# Altium schematic sheet MACH.SchDoc
size A0; SheetNumber: 1; SheetTotal: 1
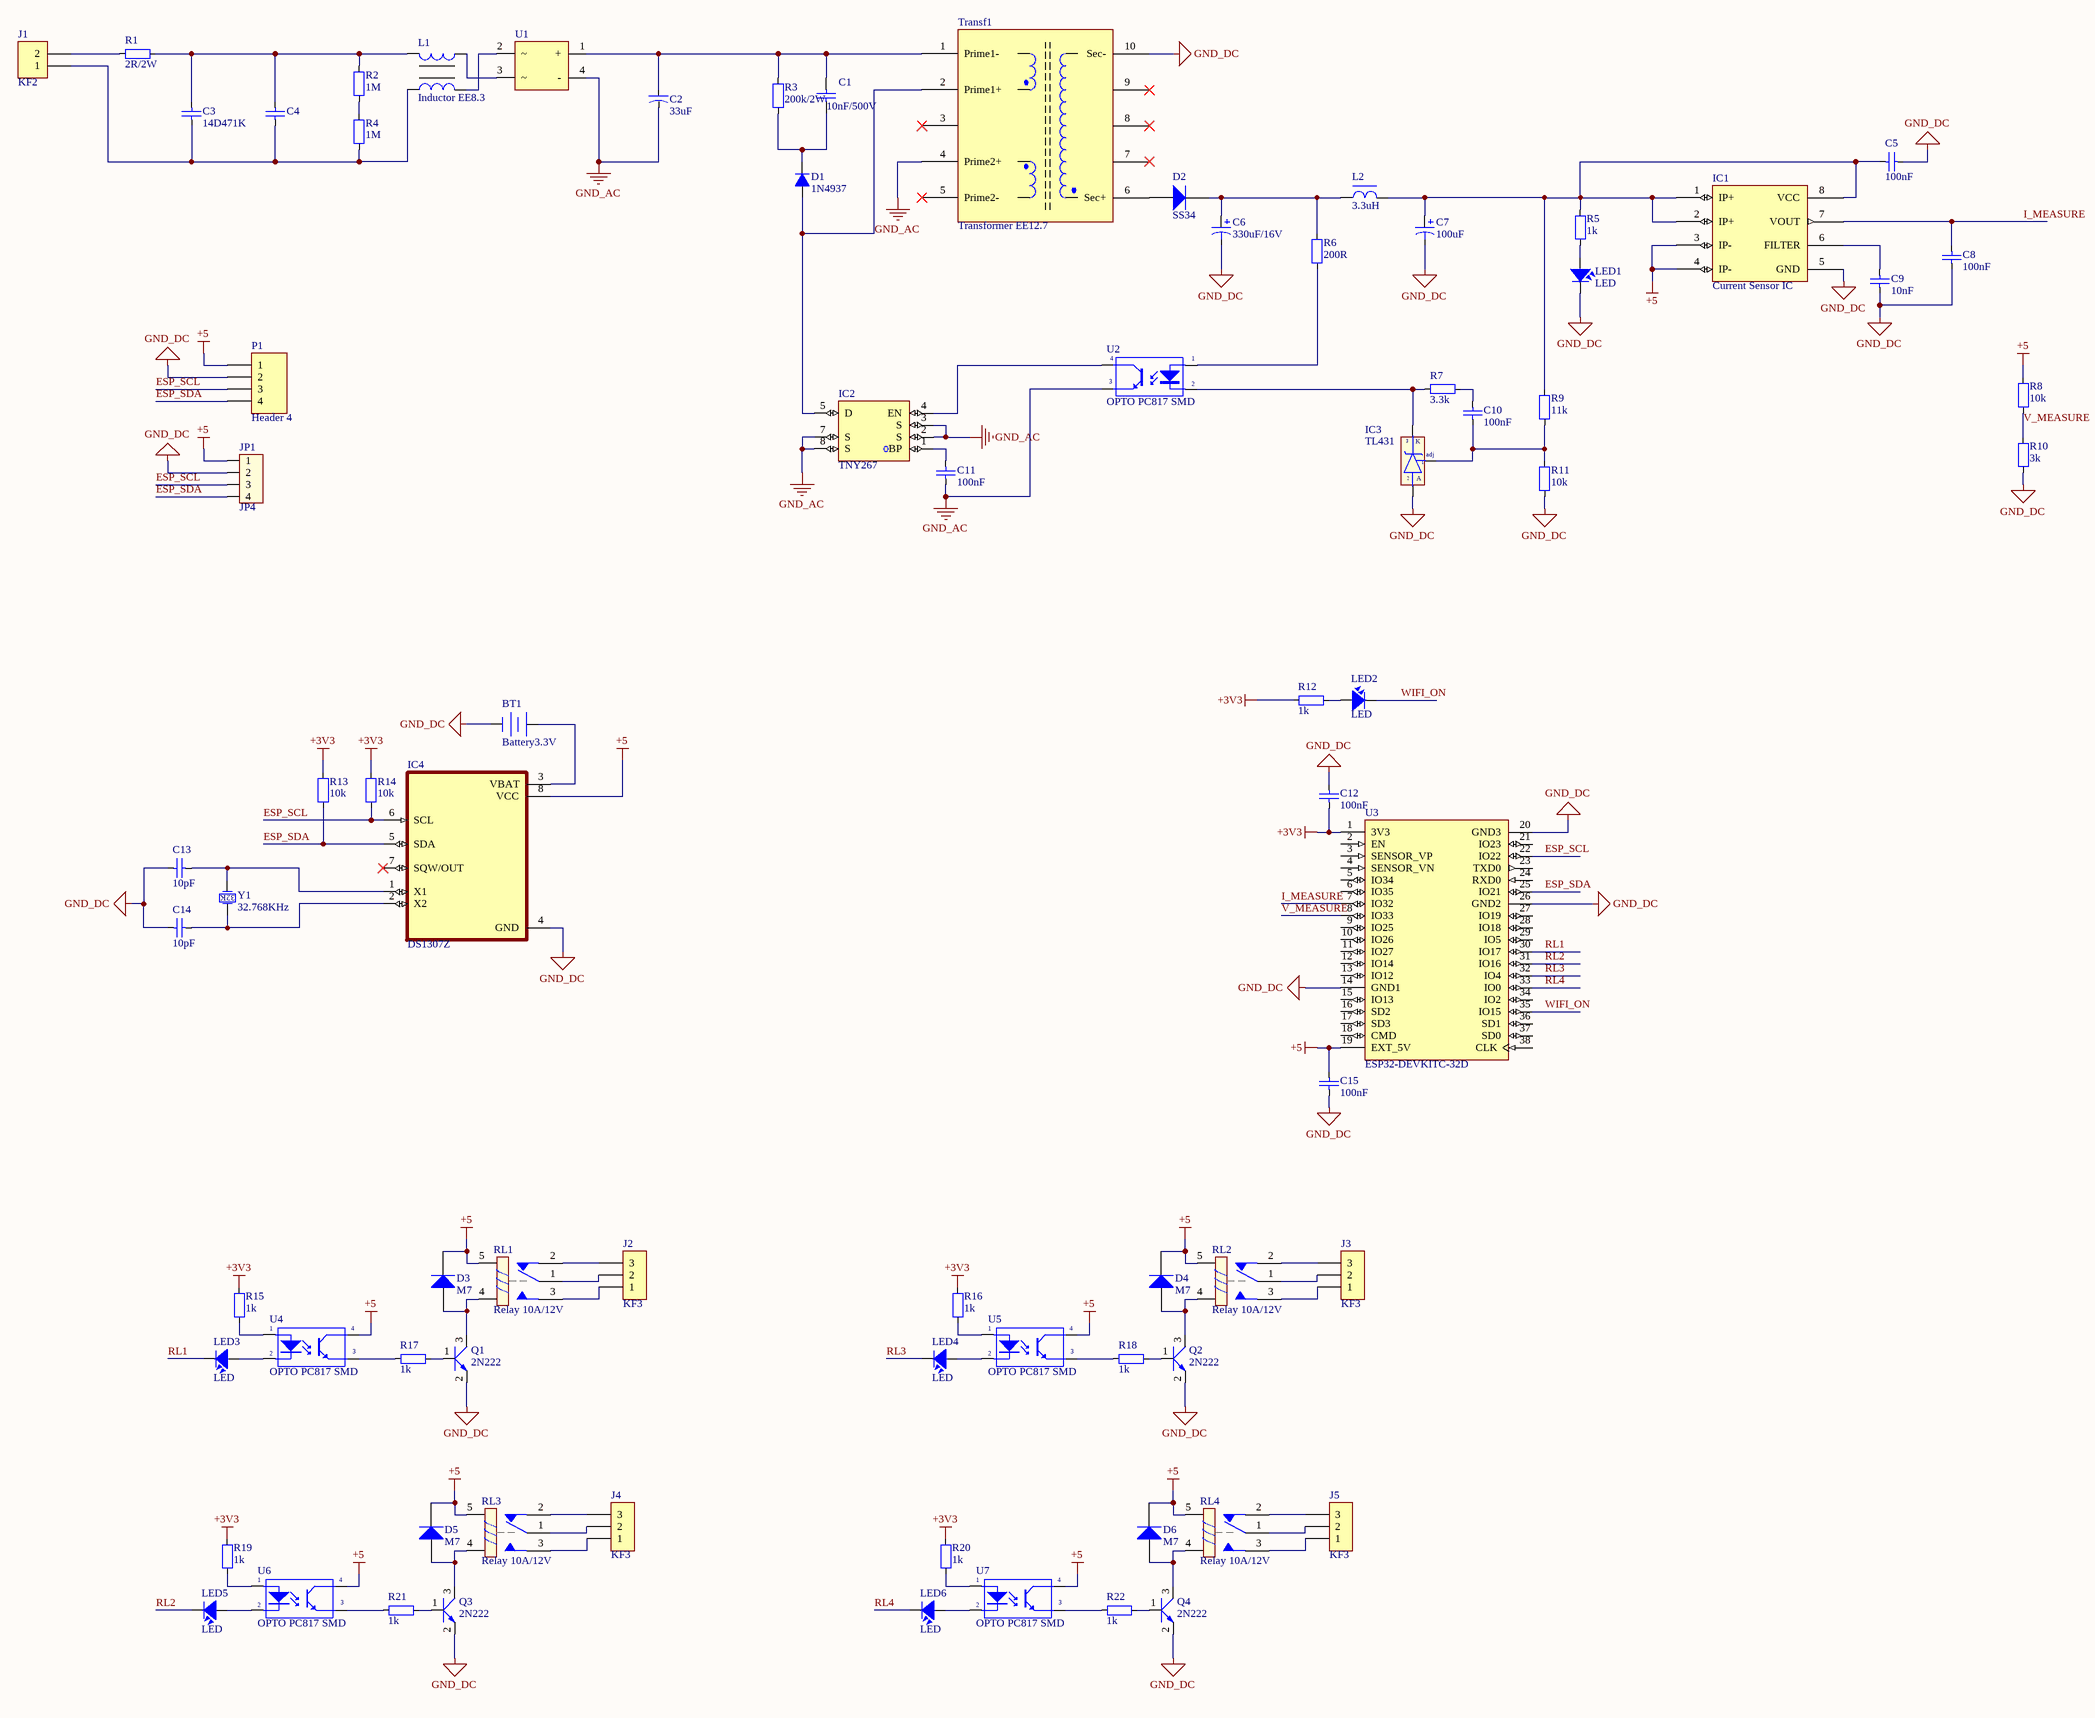
[diagram p0: MACH.SchDoc]

## Parts
BT1  Battery3.3V  [CR1220 SMD]
C1  10nF/500V  [tu gom]
C2  33uF  [CA-ALU-8]
C3  14D471K  [103/2KV]
C4  Cap AC filter  [Cap AC filter]  (value not drawn)
C5  100nF  [CAP_0805]
C6  330uF/16V  [C8mm]
C7  100uF  [C8mm]
C8  100nF  [CAP_0805]
C9  10nF  [CAP_0805]
C10  100nF  [CAP_0805]
C11  100nF  [CAP_0805]
C12  100nF  [CAP_0805]
C13  10pF  [CAP_0603]
C14  10pF  [CAP_0603]
C15  100nF  [CAP_0805]
D1  1N4937  [D5AN]
D2  SS34  [DIODE SMA]
D3  M7  [DIODE SMA]
D4  M7  [DIODE SMA]
D5  M7  [DIODE SMA]
D6  M7  [DIODE SMA]
IC1  Current Sensor IC  [SOIC-8]
IC2  TNY267  [TNY264]
IC3  TL431  [qto-92]
IC4  DS1307Z  [SOIC-8]
J1  KF2  [KF2-5.08]
J2  KF3  [KF3-5.08]
J3  KF3  [KF3-5.08]
J4  KF3  [KF3-5.08]
J5  KF3  [KF3-5.08]
JP1  JP4  [CON4]
L1  Inductor EE8.3  [Inductor EE8.3]
L2  3.3uH  [L-SMD-M-7.3x4.5]
LED1  LED  [LED-0805-Red]
LED2  LED  [LED-0805-Red]
LED3  LED  [LED-0805-Red]
LED4  LED  [LED-0805-Red]
LED5  LED  [LED-0805-Red]
LED6  LED  [LED-0805-Red]
P1  Header 4  [HDR1X4]
Q1  2N222  [SOT23D]
Q2  2N222  [SOT23D]
Q3  2N222  [SOT23D]
Q4  2N222  [SOT23D]
R1  2R/2W  [RES-1WD]
R2  1M  [RES-SMD-1206]
R3  200k/2W  [RES-1WD]
R4  1M  [RES-SMD-1206]
R5  1k  [RES-SMD-0805]
R6  200R  [RES-SMD-0805]
R7  3.3k  [RES-SMD-0805]
R8  10k  [RES-SMD-0805]
R9  11k  [RES-SMD-0805]
R10  3k  [RES-SMD-0805]
R11  10k  [RES-SMD-0805]
R12  1k  [RES-SMD-0805]
R13  10k  [RES-SMD-0805]
R14  10k  [RES-SMD-0805]
R15  1k  [RES-SMD-0805]
R16  1k  [RES-SMD-0805]
R17  1k  [RES-SMD-0805]
R18  1k  [RES-SMD-0805]
R19  1k  [RES-SMD-0805]
R20  1k  [RES-SMD-0805]
R21  1k  [RES-SMD-0805]
R22  1k  [RES-SMD-0805]
RL1  Relay 10A/12V  [RELAY 5]
RL2  Relay 10A/12V  [RELAY 5]
RL3  Relay 10A/12V  [RELAY 5]
RL4  Relay 10A/12V  [RELAY 5]
Transf1  Transformer EE12.7  [Transformer EE12.7]
U1  Diode Bridge Flate  [DB207S]  (value not drawn)
U2  OPTO PC817 SMD  [SOP4]
U3  ESP32-DEVKITC-32D  [MODULE_ESP32-DEVKITC-32D]
U4  OPTO PC817 SMD  [SOP4]
U5  OPTO PC817 SMD  [SOP4]
U6  OPTO PC817 SMD  [SOP4]
U7  OPTO PC817 SMD  [SOP4]
Y1  32.768KHz  [XTAL32K]

## Nets
+3V3: C12.1 R12.2 R13.1 R14.1 R15.1 R16.1 R19.1 R20.1 U3.1(3V3)
+5: C15.2 D3.2(K) D4.2(K) D5.2(K) D6.2(K) IC1.3(IP-) IC1.4(IP-) IC4.8(VCC) JP1.1 P1.1 R8.1 RL1.5 RL2.5 RL3.5 RL4.5 U3.19(EXT_5V) U4.4(C) U5.4(C) U6.4(C) U7.4(C)
GND: Y1.0
GND_AC: C2.2 C11.1 IC2.2(S) IC2.3(S) IC2.7(S) IC2.8(S) Transf1.4(Prime2+) U1.4(-) U2.3(E)
GND_DC: BT1.2(-) C5.2 C6.2 C7.2 C8.1 C9.2 C12.2 C13.1 C14.1 C15.1 IC1.5(GND) IC3.2(A) IC4.4(GND) JP1.2 LED1.2 P1.2 Q1.2(E) Q2.2(E) Q3.2(E) Q4.2(E) R10.1 R11.1 Transf1.10(Sec-) U3.14(GND1) U3.20(GND3) U3.26(GND2)
ESP_SCL: IC4.6(SCL) JP1.3 P1.3 R14.2 U3.22(IO22)
ESP_SDA: IC4.5(SDA) JP1.4 P1.4 R13.2 U3.25(IO21)
I_MEASURE: C8.2 IC1.7(VOUT) U3.7(IO32)
RL1: LED3.2 U3.30(IO17)
RL2: LED5.2 U3.31(IO16)
RL3: LED4.2 U3.32(IO4)
RL4: LED6.2 U3.33(IO0)
V_MEASURE: R8.2 R10.2 U3.8(IO33)
WIFI_ON: LED2.2 U3.35(IO15)
NetBT1_1: BT1.1(+) IC4.3(VBAT)
NetC1_1: C1.1 C2.1 R3.2 Transf1.1(Prime1-) U1.1(+)
NetC1_2: C1.2 D1.2(K) R3.1
NetC3_1: C3.1 C4.1 J1.1 L1.3 R4.1
NetC3_2: C3.2 C4.2 L1.1 R1.1 R2.2
NetC5_1: C5.1 C7.1 IC1.1(IP+) IC1.2(IP+) IC1.8(VCC) L2.2 R5.2 R9.2
NetC6_1: C6.1 D2.2(K) L2.1 R6.2
NetC9_1: C9.1 IC1.6(FILTER)
NetC10_1: C10.1 IC3.1(adj) R9.1 R11.2
NetC10_2: C10.2 R7.1
NetC11_2: C11.2 IC2.1(BP)
NetC13_2: C13.2 IC4.1(X1) Y1.2(OSC2)
NetC14_2: C14.2 IC4.2(X2) Y1.1(OSC1)
NetD1_1: D1.1(A) IC2.5(D) Transf1.2(Prime1+)
NetD2_1: D2.1(A) Transf1.6(Sec+)
NetD3_1: D3.1(A) Q1.3(C) RL1.4
NetD4_1: D4.1(A) Q2.3(C) RL2.4
NetD5_1: D5.1(A) Q3.3(C) RL3.4
NetD6_1: D6.1(A) Q4.3(C) RL4.4
NetIC2_4: IC2.4(EN) U2.4(C)
NetIC3_3: IC3.3(K) R7.2 U2.2(K)
NetJ1_2: J1.2 R1.2
NetJ2_1: J2.1 RL1.3
NetJ2_2: J2.2 RL1.1
NetJ2_3: J2.3 RL1.2
NetJ3_1: J3.1 RL2.3
NetJ3_2: J3.2 RL2.1
NetJ3_3: J3.3 RL2.2
NetJ4_1: J4.1 RL3.3
NetJ4_2: J4.2 RL3.1
NetJ4_3: J4.3 RL3.2
NetJ5_1: J5.1 RL4.3
NetJ5_2: J5.2 RL4.1
NetJ5_3: J5.3 RL4.2
NetL1_2: L1.2 U1.3
NetL1_4: L1.4 U1.2
NetLED1_1: LED1.1 R5.1
NetLED2_1: LED2.1 R12.1
NetLED3_1: LED3.1 U4.2(K)
NetLED4_1: LED4.1 U5.2(K)
NetLED5_1: LED5.1 U6.2(K)
NetLED6_1: LED6.1 U7.2(K)
NetQ1_1: Q1.1(B) R17.2
NetQ2_1: Q2.1(B) R18.2
NetQ3_1: Q3.1(B) R21.2
NetQ4_1: Q4.1(B) R22.2
NetR2_1: R2.1 R4.2
NetR6_1: R6.1 U2.1(A)
NetR15_2: R15.2 U4.1(A)
NetR16_2: R16.2 U5.1(A)
NetR17_1: R17.1 U4.3(E)
NetR18_1: R18.1 U5.3(E)
NetR19_2: R19.2 U6.1(A)
NetR20_2: R20.2 U7.1(A)
NetR21_1: R21.1 U6.3(E)
NetR22_1: R22.1 U7.3(E)

Not connected (* = marked no-connect by the designer): IC4 7(SQW/OUT)*; Transf1 3* 5(Prime2-)* 7* 8* 9*; U3 2(EN) 3(SENSOR_VP) 4(SENSOR_VN) 5(IO34) 6(IO35) 9(IO25) 10(IO26) 11(IO27) 12(IO14) 13(IO12) 15(IO13) 16(SD2) 17(SD3) 18(CMD) 21(IO23) 23(TXD0) 24(RXD0) 27(IO19) 28(IO18) 29(IO5) 34(IO2) 36(SD1) 37(SD0) 38(CLK)

## Notes on the sheet
- (in symbol XTAL/32KHz) 32K

## Library data of the parts
BT1 = Battery3.3V: Multicell Battery; Published: 24-Mar-1999; LatestRevisionDate: 17-Jul-2002; LatestRevisionNote: Re-released for DXP Platform.; PackageReference: BAT-2; Publisher: Altium Limited
C1 = Tu gom 103 50V: Tụ gốm 103 10nF 500V; Chung_Loai: Cắm; So_Chan: 2; Ten_Linh_Kien: Tụ gốm 103 10nF 50V; Don_Vi: Con; Ma_Hang: MH000936; Kieu_Chan: *
C2 = CAP-ALU-DIP: Capacitor (Semiconductor SIM Model); Value: 104; LatestRevisionDate: 17-Jul-2002; LatestRevisionNote: Re-released for DXP Platform.; PackageReference: C1206; Publisher: Altium Limited
C3 = Cap2KV: Capacitor Ceramic 2KV; Published: 8-Jun-2000; LatestRevisionDate: 17-Jul-2002; LatestRevisionNote: Re-released for DXP Platform.; PackageReference: RAD-0.3; Publisher: Altium Limited
C4 = Cap AC filter: Tụ lọc nguồn AC 0.1uf 275v 10mm
C5 C8-C15 = CapSMD: Capacitor; Value: 33p; Published: 8-Jun-2000; LatestRevisionDate: 17-Jul-2002; LatestRevisionNote: Re-released for DXP Platform.; PackageReference: RAD-0.3; Publisher: Altium Limited
C6 C7 = Cap Pol: Polarized Capacitor (Axial); Published: 8-Jun-2000; LatestRevisionDate: 17-Jul-2002; LatestRevisionNote: Re-released for DXP Platform.; PackageReference: POLAR0.8; Publisher: Altium Limited
D1 = D5A: Diode 5A; Value: 1N5408
D2 = Diode SS34 ( 1N5822 ): Dán; Don_Vi: Con; Ma_Hang: MH002104; Ten_Linh_Kien: Diode SS34 3A 40V SMA ( 1N5822 SS34A); Kieu_Chan: *; Chung_Loai: Dán
D3-D6 = Diode M7 ( 4007 ): Dán; Don_Vi: Con; Ten_Linh_Kien: Diode M7 1N4007 SMD 1A 1000V; Ma_Hang: MH000944; Chung_Loai: Dán; Ghi_Chu: *
IC1 = ACS712
IC2 = TNY264: IC Power
IC3 = TL431: Programmable Shunt Regulator; Value: TL431
IC4 = DS1307Z: 0x68
J1 = KF2: Manufacturer: Würth Elektronik eiSos GmbH; partNo: 691103110002; ComponentLink1 Description: Manufacturer; ComponentLink2 Description: Datasheet; NoPins: 2; Created Date: 29 October 2013; ComponentLink1URL: http://www.we-online.com; ComponentLink2URL: http://katalog.we-online.de/em/datasheet/6911031100xx.pdf; Created by: Karrer Zheng
J2-J5 = KF3: Manufacturer: Würth Elektronik eiSos GmbH; partNo: 691103110003; ComponentLink1 Description: Manufacturer; ComponentLink2 Description: Datasheet; NoPins: 3; Created Date: 29 October 2013; ComponentLink1URL: http://www.we-online.com; ComponentLink2URL: http://katalog.we-online.de/em/datasheet/6911031100xx.pdf; Created by: Karrer Zheng
JP1 = Con4: Connector 4; Value: Connector 4
L2 = L-DIP-1: Inductor; Value: 150 mH
LED1-LED6 = LED: LED Single colour Green and Red; Value: LED 3 ly Single Colour
P1 = Header 4: Header, 4-Pin; LatestRevisionDate: 17-Jul-2002; LatestRevisionNote: Re-released for DXP Platform.; Publisher: Altium Limited
Q1-Q4 = 2N222: NPN 600mW, ECB; Value: C1815
R1 R3 = Resistor - DIP: Value: R1/4W - 1K
R2 R4-R22 = Resistor - SMD: Resistor; Manufacturer: Generic Components; Class: Passive; Published: 08/06/2000; Publisher: Altium Hobart Technology Centre
RL1-RL4 = Relay 5: Relay SPDT,10A - 12VDC 5 Pin; Value: Relay SPDT, 10A, 12V
Transf1 = Tranformer EE16
U1 = Diode Bridge Flate: Diode Bridge
U2 U4-U7 = OPTO PC817 SMD: Single Opto; Value: PC817
U3 = ESP32-DEVKITC-32D: EVAL BOARD FOR ESP-WROOM-32; MF: Espressif Systems; Value: *; MP: ESP32-DEVKITC-32D; Price: None; Check_prices: https://www.snapeda.com/parts/ESP32-DEVKITC-32D/Espressif%20Systems/view-part/2777395/?ref=eda; SnapEDA_Link: https://www.snapeda.com/parts/ESP32-DEVKITC-32D/Espressif%20Systems/view-part/2777395/?ref=snap; Availability: Warning; Purchase-URL: https://pricing.snapeda.com/search/part/ESP32-DEVKITC-32D/?ref=eda; Package: None
Y1 = XTAL/32KHz: Crystal Oscillator; Published: 8-Jun-2000; LatestRevisionDate: 17-Jul-2002; LatestRevisionNote: Re-released for DXP Platform.; PackageReference: R38; Publisher: Altium Limited